# EAGLE design modular_expansion_system_audio_mixer (EAGLE 9.2.1)
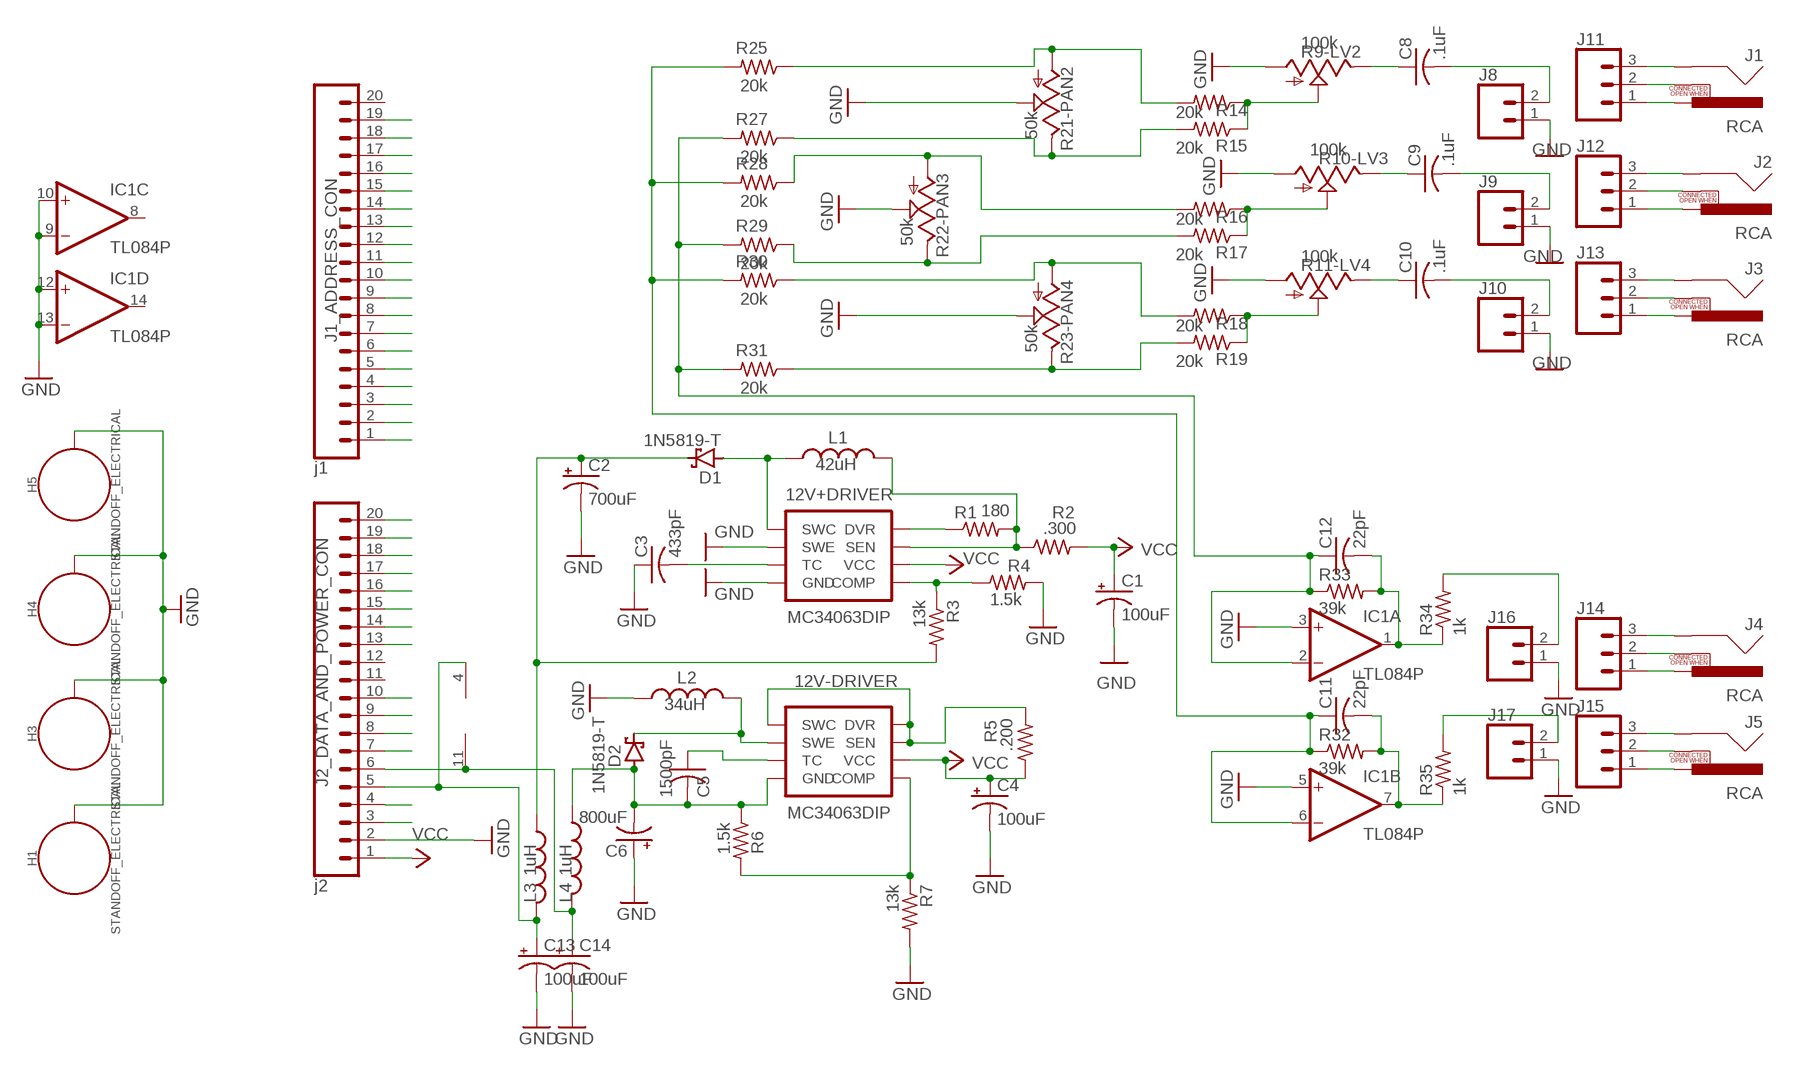
[diagram p0: schematic, sheet 1]

## Parts
12V+DRIVER  MC34063DIP  [DIP-08]
12V-DRIVER  MC34063DIP  [DIP-08]
C1  100uF  CPOL-USE2.5-5  [E2,5-5]
C2  700uF  CPOL-USE3.5-10  [E3,5-10]
C3  433pF  C-US025-040X050  [C025-040X050]
C4  100uF  CPOL-USE2.5-5  [E2,5-5]
C5  1500pF  C-US025-040X050  [C025-040X050]
C6  800uF  CPOL-USE3.5-10  [E3,5-10]
C8  .1uF  C-US025-024X044  [C025-024X044]
C9  .1uF  C-US025-024X044  [C025-024X044]
C10  .1uF  C-US025-024X044  [C025-024X044]
C11  22pF  C-US025-024X044  [C025-024X044]
C12  22pF  C-US025-024X044  [C025-024X044]
C13  100uF  CPOL-USE2.5-5  [E2,5-5]
C14  100uF  CPOL-USE2.5-5  [E2,5-5]
D1  1N5819-T  [DO41-7.6]
D2  1N5819-T  [DO41-7.6]
H1  STANDOFF_ELECTRICAL  [STANDOFF-ELECTRICAL]
H3  STANDOFF_ELECTRICAL  [STANDOFF-ELECTRICAL]
H4  STANDOFF_ELECTRICAL  [STANDOFF-ELECTRICAL]
H5  STANDOFF_ELECTRICAL  [STANDOFF-ELECTRICAL]
IC1  TL084P  [DIL14]
J1  RCA  [RCA]
J1_ADDRESS_CON  j1  CONN_20  [1X20]
J2  RCA  [RCA]
J2_DATA_AND_POWER_CON  j2  CONN_20  [1X20]
J3  RCA  [RCA]
J4  RCA  [RCA]
J5  RCA  [RCA]
J8  CONN_02  [1X02]
J9  CONN_02  [1X02]
J10  CONN_02  [1X02]
J11  CONN_03  [1X03]
J12  CONN_03  [1X03]
J13  CONN_03  [1X03]
J14  CONN_03  [1X03]
J15  CONN_03  [1X03]
J16  CONN_02  [1X02]
J17  CONN_02  [1X02]
L1  42uH  L-US0207/7  [0207/7]
L2  34uH  L-US0207/7  [0207/7]
L3  1uH  L-US0207/5V  [0207/5V]
L4  1uH  L-US0207/5V  [0207/5V]
R1  180  R-US_0204/2V  [0204V]
R2  .300  R-US_0204/2V  [0204V]
R3  13k  R-US_0204/2V  [0204V]
R4  1.5k  R-US_0204/2V  [0204V]
R5  .200  R-US_0204/2V  [0204V]
R6  1.5k  R-US_0204/2V  [0204V]
R7  13k  R-US_0204/2V  [0204V]
R9-LV2  100k  TRIM_US-B25U  [B25U]
R10-LV3  100k  TRIM_US-B25U  [B25U]
R11-LV4  100k  TRIM_US-B25U  [B25U]
R14  20k  R-US_0204/2V  [0204V]
R15  20k  R-US_0204/2V  [0204V]
R16  20k  R-US_0204/2V  [0204V]
R17  20k  R-US_0204/2V  [0204V]
R18  20k  R-US_0204/2V  [0204V]
R19  20k  R-US_0204/2V  [0204V]
R21-PAN2  50k  TRIM_US-B25U  [B25U]
R22-PAN3  50k  TRIM_US-B25U  [B25U]
R23-PAN4  50k  TRIM_US-B25U  [B25U]
R25  20k  R-US_0204/2V  [0204V]
R27  20k  R-US_0204/2V  [0204V]
R28  20k  R-US_0204/2V  [0204V]
R29  20k  R-US_0204/2V  [0204V]
R30  20k  R-US_0204/2V  [0204V]
R31  20k  R-US_0204/2V  [0204V]
R32  39k  R-US_0204/2V  [0204V]
R33  39k  R-US_0204/2V  [0204V]
R34  1k  R-US_0204/2V  [0204V]
R35  1k  R-US_0204/2V  [0204V]

## Nets
+12V: C2.+ D1.C L3.1 R3.2
+12V_FILTERED: C13.+ IC1.4(P:V+) J2_DATA_AND_POWER_CON.5 L3.2
-12V: 12V-DRIVER.4(GND) C5.2 C6.- D2.A L4.1 R6.1
-12V-FILTERED: C14.+ IC1.11(P:V-) J2_DATA_AND_POWER_CON.6 L4.2
A0: J1_ADDRESS_CON.1
A1: J1_ADDRESS_CON.2
A2: J1_ADDRESS_CON.3
A3: J1_ADDRESS_CON.4
A4: J1_ADDRESS_CON.5
A5: J1_ADDRESS_CON.6
A6: J1_ADDRESS_CON.7
A7: J1_ADDRESS_CON.8
A8: J1_ADDRESS_CON.9
A9: J1_ADDRESS_CON.10
A10: J1_ADDRESS_CON.11
A11: J1_ADDRESS_CON.12
A12: J1_ADDRESS_CON.13
A13: J1_ADDRESS_CON.14
A14: J1_ADDRESS_CON.15
A15: J1_ADDRESS_CON.16
CAS*: J2_DATA_AND_POWER_CON.9
D0: J2_DATA_AND_POWER_CON.20
D1: J2_DATA_AND_POWER_CON.19
D2: J2_DATA_AND_POWER_CON.18
D3: J2_DATA_AND_POWER_CON.17
D4: J2_DATA_AND_POWER_CON.16
D5: J2_DATA_AND_POWER_CON.15
D6: J2_DATA_AND_POWER_CON.14
D7: J2_DATA_AND_POWER_CON.13
GND: 12V+DRIVER.2(SWE) 12V+DRIVER.4(GND) C1.- C2.- C3.1 C4.- C6.+ C13.- C14.- H1.P1 H3.P1 H4.P1 H5.P1 IC1.3(A:+IN) IC1.5(B:+IN) IC1.9(C:-IN) IC1.10(C:+IN) IC1.12(D:+IN) IC1.13(D:-IN) J2_DATA_AND_POWER_CON.2 J8.1 J9.1 J10.1 J16.1 J17.1 L2.1 R4.2 R7.2 R9-LV2.A R10-LV3.A R11-LV4.A R21-PAN2.S R22-PAN3.S R23-PAN4.S
IN*: J1_ADDRESS_CON.17
INTAK*: J2_DATA_AND_POWER_CON.7
N$1: 12V+DRIVER.8(DVR) R1.1
N$2: 12V+DRIVER.7(SEN) L1.2 R1.2 R2.1
N$3: 12V+DRIVER.1(SWC) D1.A L1.1
N$4: 12V+DRIVER.3(TC) C3.2
N$5: 12V+DRIVER.5(COMP) R3.1 R4.1
N$6: 12V-DRIVER.1(SWC) 12V-DRIVER.7(SEN) 12V-DRIVER.8(DVR) R5.2
N$7: 12V-DRIVER.3(TC) C5.1
N$8: 12V-DRIVER.2(SWE) D2.C L2.2
N$9: 12V-DRIVER.5(COMP) R6.2 R7.1
N$15: J3.SHELL J13.3
N$16: J3.SWITCH J13.2
N$17: J3.PIN J13.1
N$18: J2.PIN J12.1
N$19: J2.SWITCH J12.2
N$20: J2.SHELL J12.3
N$21: J1.SHELL J11.3
N$22: J1.SWITCH J11.2
N$23: J1.PIN J11.1
N$24: J4.SHELL J14.3
N$25: J4.SWITCH J14.2
N$26: J4.PIN J14.1
N$27: J5.SHELL J15.3
N$28: J5.SWITCH J15.2
N$29: J5.PIN J15.1
N$31: C8.1 R9-LV2.E
N$32: C9.1 R10-LV3.E
N$33: C10.1 R11-LV4.E
N$35: C8.2 J8.2
N$36: C10.2 J10.2
N$37: C9.2 J9.2
N$39: R9-LV2.S R14.1 R15.1
N$40: R10-LV3.S R16.1 R17.1
N$41: R11-LV4.S R18.1 R19.1
N$44: R14.2 R21-PAN2.A R25.1
N$45: R15.2 R21-PAN2.E R27.1
N$46: R16.2 R22-PAN3.A R28.1
N$47: R17.2 R22-PAN3.E R29.1
N$48: R18.2 R23-PAN4.A R30.1
N$49: R19.2 R23-PAN4.E R31.1
N$51: C11.1 IC1.6(B:-IN) R25.2 R28.2 R30.2 R32.1
N$53: C12.2 IC1.1(A:OUT) R33.2 R34.1
N$54: C12.1 IC1.2(A:-IN) R27.2 R29.2 R31.2 R33.1
N$56: C11.2 IC1.7(B:OUT) R32.2 R35.1
N$60: J16.2 R34.2
N$61: J17.2 R35.2
OUT*: J1_ADDRESS_CON.18
RAS*: J2_DATA_AND_POWER_CON.10
RD*: J1_ADDRESS_CON.19
SYSRES*: J2_DATA_AND_POWER_CON.8
UNREG+: J2_DATA_AND_POWER_CON.4
VCC: 12V+DRIVER.6(VCC) 12V-DRIVER.6(VCC) C1.+ C4.+ J2_DATA_AND_POWER_CON.1 R2.2 R5.1
VCC/2: J2_DATA_AND_POWER_CON.3
Unconnected: IC1.8(C:OUT) IC1.14(D:OUT) J1_ADDRESS_CON.20 J2_DATA_AND_POWER_CON.11 J2_DATA_AND_POWER_CON.12

## Library data of the parts
12V+DRIVER 12V-DRIVER = SparkFun-IC-Power:MC34063: Jellybean switching supply controller (IC-11612, also SF)
C1 C2 C4 C6 C13 C14 = resistor:CPOL-US: POLARIZED CAPACITOR, American symbol
C3 C5 C8-C12 = rcl:C-US: CAPACITOR, American symbol; SPICEPREFIX: C
D1 D2 = diode:1N581*: 1.0A SCHOTTKY BARRIER RECTIFIER Source: http://www.diodes.com/datasheets/ds23001.pdf
H1 H3-H5 = SparkFun-Hardware:STANDOFF_ELECTRICAL: Stand Off Drill holes with an electrical connection. For example, use these to ground your board to a chassis. Example SparkFun Products Screw - Phillips Head (1/4", 4-40, 10 pack) <https://www.sparkfun.com/products/10453> (PRT-10453) Screw - Phillips Head (1/2", 4-40, 10 pack) <https://www.sparkfun.com/products/10452> (PRT-10452) Screw - Phillips Head (3/4", 4-40, 10 pack) <https://www.sparkfun.com/products/10451> (PRT-10451) Screw - Phillips Head (1", 4-40, 10 pack) <https://www.sparkfun.com/products/10450> (PRT-10450)
IC1 = linear:TL084: OP AMP
J1-J5 = SparkFun-Connectors:RCA: RCA Jack connector This is a right angle RCA jack connecotr. Commonly used for video or audio. Here is the connector we sell at SparkFun: RCA Jack <https://www.sparkfun.com/products/8631> (PRT-08631) Datasheet <http://www.sparkfun.com/datasheets/Prototyping/Connectors/RCA-Jack.pdf> It is not used on any active designs, however it was used on a couple retired products: RCA Jack Breakout [RETIRED] <https://www.sparkfun.com/products/8826> (PRT-08826) SparkFun On Screen Display Breakout - MAX7456 [RETIRED] <https://www.sparkfun.com/products/9168> (BOB-09168) You may also be interested in a cable: RCA Video Cable - 6' <https://www.sparkfun.com/products/11573> (CAB-11573); PROD_ID: CONN-09081; SF_ID: PRT-08631
J1_ADDRESS_CON J2_DATA_AND_POWER_CON = SparkFun-Connectors:CONN_20: Multi connection point. Often used as Generic Header-pin footprint for 0.1 inch spaced/style header connections On any of the 0.1 inch spaced packages, you can populate with these: Break Away Headers - Straight <https://www.sparkfun.com/products/116> (PRT-00116) Break Away Male Headers - Right Angle <https://www.sparkfun.com/products/553> (PRT-00553) Female Headers <https://www.sparkfun.com/products/115> (PRT-00115) Break Away Headers - Machine Pin <https://www.sparkfun.com/products/117> (PRT-00117) Break Away Female Headers - Swiss Machine Pin <https://www.sparkfun.com/products/743> (PRT-00743) For SCREWTERMINALS and SPRING TERMINALS visit here: Screw Terimnals on SparkFun.com <https://www.sparkfun.com/search/results?term=Screw+Terminals> (5mm/3.5mm/2.54mm spacing) This device is also useful as a general connection point to wire up your design to another part of your project. Our various solder wires solder well into these plated through hole pads. Hook-Up Wire - Assortment (Stranded, 22 AWG) <https://www.sparkfun.com/products/11375> (PRT-11375) Hook-Up Wire - Assortment (Solid Core, 22 AWG) <https://www.sparkfun.com/products/11367> (PRT-11367) View the entire wire category on our website here <https://www.sparkfun.com/categories/141> Special notes: Molex polarized connector foot print use with SKU : PRT-08231 with associated crimp pins and housings. 1MM SMD Version SKU: PRT-10208 NOTES ON THE VARIANTS LOCK and LOCK_LONGPADS... This footprint was designed to help hold the alignment of a through-hole component (i.e. 6-pin header) while soldering it into place. You may notice that each hole has been shifted either up or down by 0.005 of an inch from it's more standard position (which is a perfectly straight line). This slight alteration caused the pins (the squares in the middle) to touch the edges of the holes. Because they are alternating, it causes a "brace" to hold the component in place. 0.005 has proven to be the perfect amount of "off-center" position when using our standard breakaway headers. Although looks a little odd when you look at the bare footprint, once you have a header in there, the alteration is very hard to notice. Also,if you push a header all the way into place, it is covered up entirely on the bottom side. Note about LOCK SPECIAL package: This is just like the LOCK variant in that the holes are staggared by 5 mil, but except for the last two holes. They are not altered from the "standard" footprint layout. This is used for a special purpose on the layout of our Graphic LCD Backpack. Make sure you want to use this device before selecting it for you project!
J8-J10 J16 J17 = SparkFun-Connectors:CONN_02: Multi connection point. Often used as Generic Header-pin footprint for 0.1 inch spaced/style header connections On any of the 0.1 inch spaced packages, you can populate with these: Break Away Headers - Straight <https://www.sparkfun.com/products/116> (PRT-00116) Break Away Male Headers - Right Angle <https://www.sparkfun.com/products/553> (PRT-00553) Female Headers <https://www.sparkfun.com/products/115> (PRT-00115) Break Away Headers - Machine Pin <https://www.sparkfun.com/products/117> (PRT-00117) Break Away Female Headers - Swiss Machine Pin <https://www.sparkfun.com/products/743> (PRT-00743) For SCREWTERMINALS and SPRING TERMINALS visit here: Screw Terimnals on SparkFun.com <https://www.sparkfun.com/search/results?term=Screw+Terminals> (5mm/3.5mm/2.54mm spacing) This device is also useful as a general connection point to wire up your design to another part of your project. Our various solder wires solder well into these plated through hole pads. Hook-Up Wire - Assortment (Stranded, 22 AWG) <https://www.sparkfun.com/products/11375> (PRT-11375) Hook-Up Wire - Assortment (Solid Core, 22 AWG) <https://www.sparkfun.com/products/11367> (PRT-11367) View the entire wire category on our website here <https://www.sparkfun.com/categories/141> Special notes: Molex polarized connector foot print use with: PRT-08233 with associated crimp pins and housings. 2.54_SCREWTERM for use with PRT-10571. 3.5mm Screw Terminal footprints for PRT-08084 5mm Screw Terminal footprints for use with PRT-08432
J11-J15 = SparkFun-Connectors:CONN_03: Multi connection point. Often used as Generic Header-pin footprint for 0.1 inch spaced/style header connections On any of the 0.1 inch spaced packages, you can populate with these: Break Away Headers - Straight <https://www.sparkfun.com/products/116> (PRT-00116) Break Away Male Headers - Right Angle <https://www.sparkfun.com/products/553> (PRT-00553) Female Headers <https://www.sparkfun.com/products/115> (PRT-00115) Break Away Headers - Machine Pin <https://www.sparkfun.com/products/117> (PRT-00117) Break Away Female Headers - Swiss Machine Pin <https://www.sparkfun.com/products/743> (PRT-00743) Stackable Header - 3 Pin (Female, 0.1") <https://www.sparkfun.com/products/13875> (PRT-13875) For SCREWTERMINALS and SPRING TERMINALS visit here: Screw Terimnals on SparkFun.com <https://www.sparkfun.com/search/results?term=Screw+Terminals> (5mm/3.5mm/2.54mm spacing) This device is also useful as a general connection point to wire up your design to another part of your project. Our various solder wires solder well into these plated through hole pads. Hook-Up Wire - Assortment (Stranded, 22 AWG) <https://www.sparkfun.com/products/11375> (PRT-11375) Hook-Up Wire - Assortment (Solid Core, 22 AWG) <https://www.sparkfun.com/products/11367> (PRT-11367) View the entire wire category on our website here <https://www.sparkfun.com/categories/141> Special notes: Molex polarized connector foot print use with SKU : PRT-08232 with associated crimp pins and housings.
L1 L2 = resistor:L-US: INDUCTOR, American symbol
L3 L4 = rcl:L-US: INDUCTOR, American symbol; SPICEPREFIX: L
R1-R7 R14-R19 R25 R27-R35 = resistor:R-US_: RESISTOR, American symbol
R9-LV2 R10-LV3 R11-LV4 R21-PAN2 R22-PAN3 R23-PAN4 = pot:TRIM_US-: POTENTIOMETER

## Net classes
0 default: width 0.3 mm

## Board
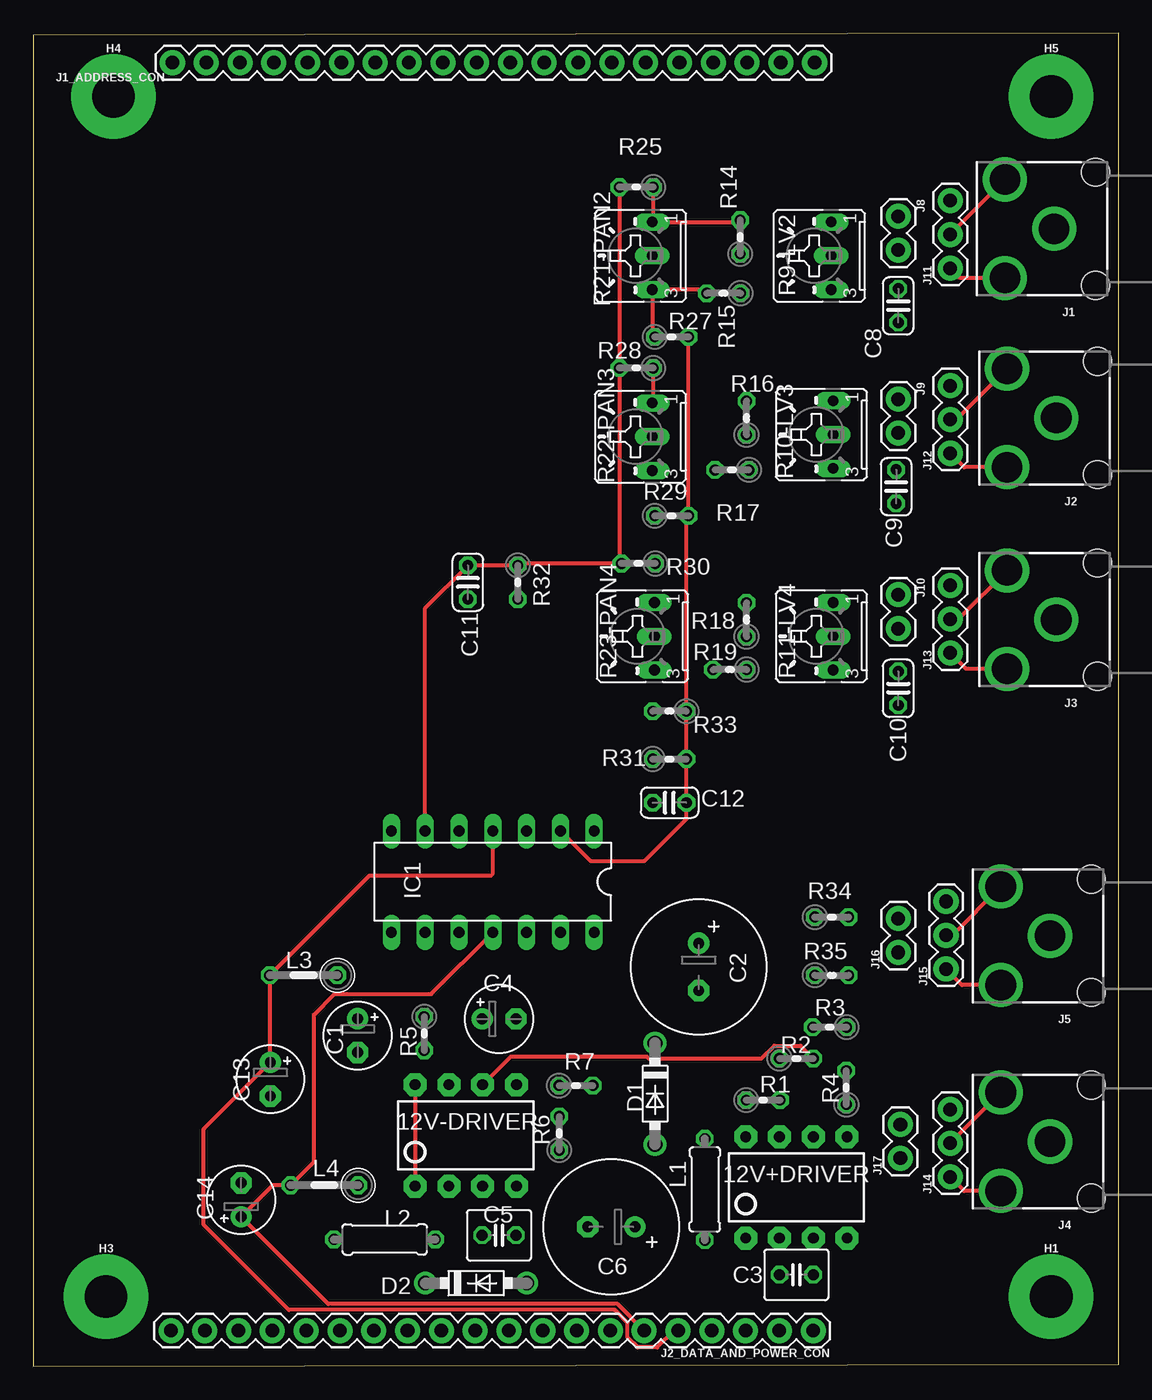
[diagram p1: board, top side]
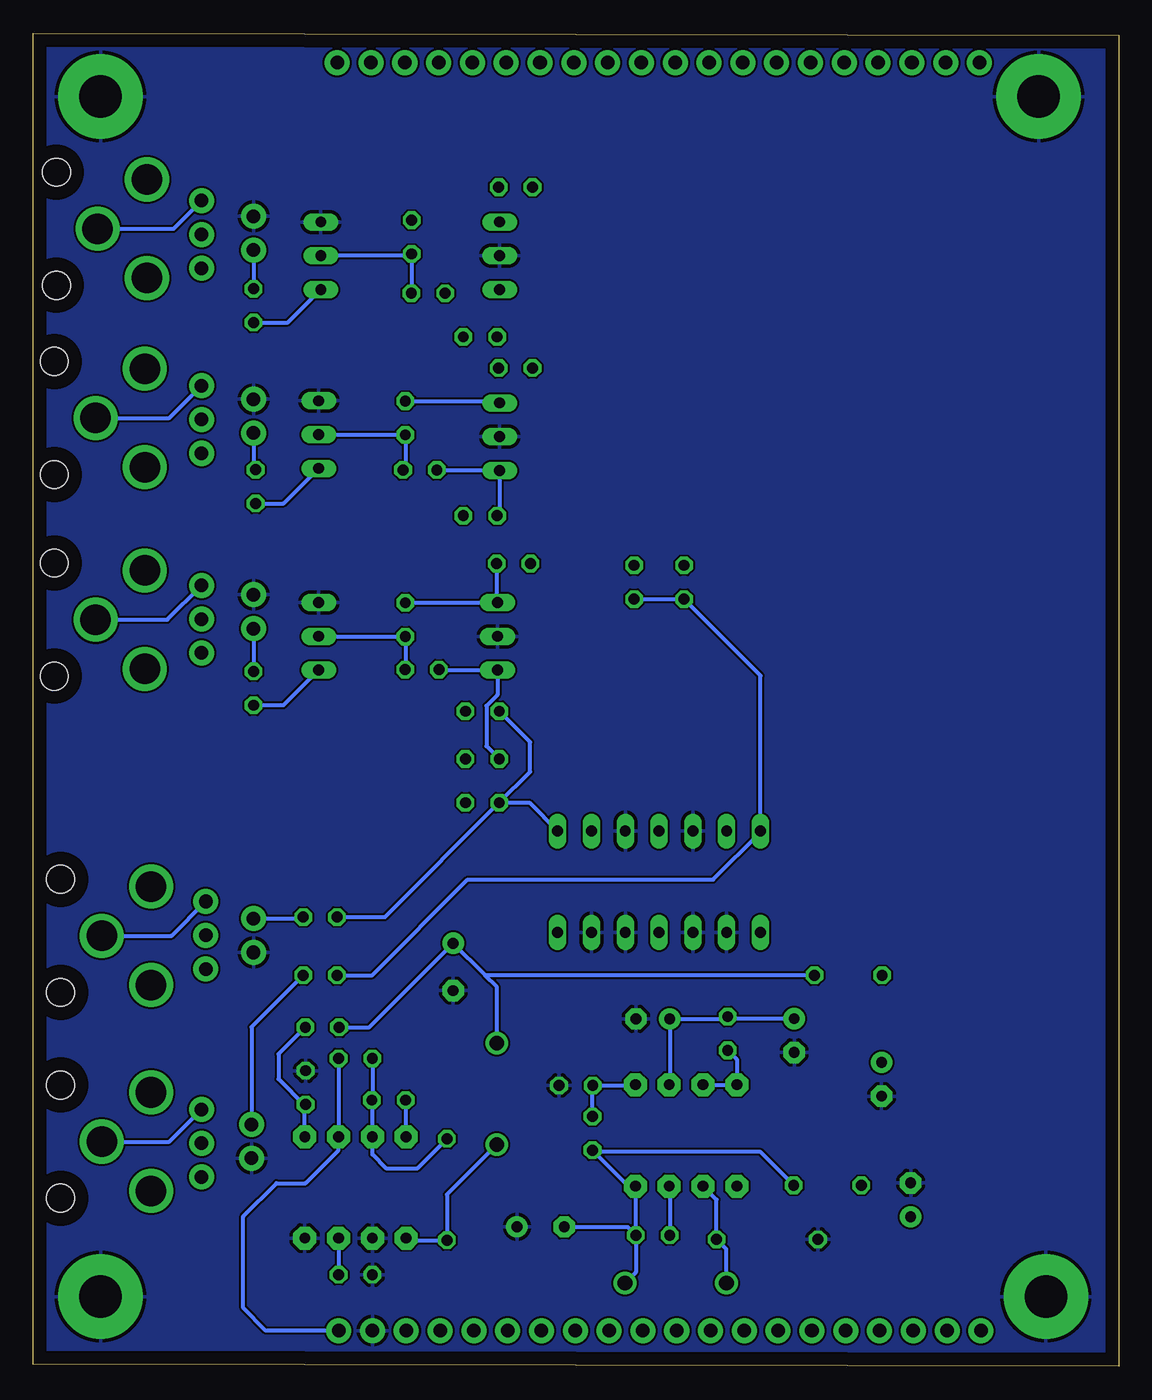
[diagram p2: board, bottom side, seen from below]

Size 81.56 x 100.16 mm. Coordinates in mm from the lower left corner, seen from the top.
Outline: 0,0 81.56,0.16 81.56,100.16 0,100 0,0
Copper layers (1*16): Top 0.035mm / dielectric 1.5mm / Bottom 0.035mm
Design rules "default": minimum track width 6mil, minimum drill 0.35mm, track to track 6mil, track to pad 6mil, pad to pad 6mil, via to via 6mil, smd to smd 6mil, copper to edge 40mil, drill to drill 6mil, minimum pad ring 10mil, minimum via ring 8mil, stop-mask expansion 4mil, vias tented up to drill 0mil, thermal gap 10mil

### Footprints (pad centres in the part's own frame; a part is rotated, then mirrored left to right if it is on the bottom)
DIP-08 = drill 0.813 pad 1.727 octagon: 1 -3.81,-3.81; 2 -1.27,-3.81; 3 1.27,-3.81; 4 3.81,-3.81; 5 3.81,3.81; 6 1.27,3.81; 7 -1.27,3.81; 8 -3.81,3.81
E2,5-5 = drill 0.813 pad 1.6: + -1.27,0 | drill 0.813 pad 1.6 octagon: - 1.27,0
E3,5-10 = drill 0.813 pad 1.6: + -1.778,0 | drill 0.813 pad 1.6 octagon: - 1.778,0
C025-040X050 = drill 0.813 octagon: 1 -1.27,0; 2 1.27,0
C025-024X044 = drill 0.813 octagon: 1 -1.27,0; 2 1.27,0
DO41-7.6 = drill 1.1 pad 1.7: A 3.81,0; C -3.81,0
STANDOFF-ELECTRICAL = drill 3.2 pad 6.35: P1 0,0
DIL14 = drill 0.813 long: 1 -7.62,-3.81; 2 -5.08,-3.81; 3 -2.54,-3.81; 4 0,-3.81; 5 2.54,-3.81; 6 5.08,-3.81; 7 7.62,-3.81; 8 7.62,3.81; 9 5.08,3.81; 10 2.54,3.81; 11 0,3.81; 12 -2.54,3.81; 13 -5.08,3.81; 14 -7.62,3.81
RCA = drill 2.3: PIN 3.7,3.7; SHELL 0,0; SWITCH 3.7,-3.7 | hole 2.1: -3.1,4.25; -3.1,-4.25
1X20 = drill 1.016 pad 1.88: 1 0,0; 2 2.54,0; 3 5.08,0; 4 7.62,0; 5 10.16,0; 6 12.7,0; 7 15.24,0; 8 17.78,0; 9 20.32,0; 10 22.86,0; 11 25.4,0; 12 27.94,0; 13 30.48,0; 14 33.02,0; 15 35.56,0; 16 38.1,0; 17 40.64,0; 18 43.18,0; 19 45.72,0; 20 48.26,0
1X02 = drill 1.016 pad 1.88: 1 0,0; 2 2.54,0
1X03 = drill 1.016 pad 1.88: 1 0,0; 2 2.54,0; 3 5.08,0
0207/7 = drill 0.813 octagon: 1 -3.81,0; 2 3.81,0
0207/5V = drill 0.813 octagon: 1 -2.54,0; 2 2.54,0
0204V = drill 0.813 octagon: 1 -1.27,0; 2 1.27,0
B25U = drill 0.813 long: A 2.54,-0.889; E -2.54,-0.889; S 0,-0.889

### Placement (x,y rotation side)
12V+DRIVER  57.34,13.44 0 top
12V-DRIVER  32.5,17.34 0 top
C1  24.38,24.84 270 top
C2  50,30 270 top
C3  57.34,6.88 0 top
C4  35,26.09 0 top
C5  35,9.84 0 top
C6  43.44,10.47 180 top
C8  65,79.69 90 top
C9  64.84,66.09 90 top
C10  65,50.94 90 top
C11  32.66,58.91 270 top
C12  47.81,42.34 180 top
C13  17.81,21.56 270 top
C14  15.62,12.5 90 top
D1  46.72,20.47 270 top
D2  33.28,6.25 0 top
H1  76.5,5.24 0 top
H3  5.47,5.24 0 top
H4  6.01,95.41 0 top
H5  76.5,95.41 0 top
IC1  34.53,36.41 180 top
J1  76.72,85.47 180 top
J1_ADDRESS_CON  10.46,97.95 0 top
J2  76.88,71.25 180 top
J2_DATA_AND_POWER_CON  58.61,2.68 180 top
J3  76.88,56.09 180 top
J4  76.41,16.88 180 top
J5  76.41,32.34 180 top
J8  65,86.41 270 top
J9  65,72.66 270 top
J10  65,57.97 270 top
J11  68.91,82.5 90 top
J12  68.91,68.59 90 top
J13  68.91,53.59 90 top
J14  68.91,14.22 90 top
J15  68.59,29.84 90 top
J16  65,31.09 90 top
J17  65.16,15.62 90 top
L1  50.47,13.28 90 top
L2  26.41,9.53 0 top
L3  20.31,29.38 180 top
L4  21.88,13.59 180 top
R1  54.84,20 0 top
R2  57.34,23.12 0 top
R3  59.84,25.47 180 top
R4  61.09,20.94 90 top
R5  29.38,25 270 top
R6  39.53,17.5 90 top
R7  40.78,21.09 0 top
R9-LV2  59.06,83.44 90 top
R10-LV3  59.22,70 90 top
R11-LV4  59.22,54.84 90 top
R14  53.12,84.84 90 top
R15  51.88,80.62 180 top
R16  53.59,71.25 90 top
R17  52.5,67.34 180 top
R18  53.59,56.09 90 top
R19  52.34,52.34 180 top
R21-PAN2  45.62,83.44 90 top
R22-PAN3  45.62,69.84 90 top
R23-PAN4  45.78,54.84 90 top
R25  45.31,88.59 180 top
R27  47.97,77.34 0 top
R28  45.31,75 180 top
R29  47.97,63.91 0 top
R30  45.47,60.31 180 top
R31  47.81,45.62 0 top
R32  36.41,58.91 270 top
R33  47.81,49.22 180 top
R34  60,33.75 0 top
R35  60,29.38 0 top

### Tracks (layer width: path | path; a pad name or v marks a point on that pad's centre or on a via)
+12V
  Bottom 0.3: R3.2 56.31,25.47 C2.+ 47.63,29.4 47.6,29.37 | D1.C 46.72,28.5 47.6,29.37 | L3.1 47.6,29.37
+12V_FILTERED
  Top 0.3: J2_DATA_AND_POWER_CON.5 48.15,2.68 46.88,1.41 45.42,1.41 44.66,2.16 44.66,3.28 43.71,4.23 19.2,4.23 12.81,10.62 12.81,17.83 C13.+ 17.77,22.87 L3.2 25.27,36.87 34.38,36.87 34.53,37.03 IC1.4
-12V
  Bottom 0.3: C5.2 36.27,7.07 D2.A | C6.- 36.9,10.47 C5.2 | C5.2 36.31,9.88 12V-DRIVER.4 36.84,13.53 R6.1 39.4,16.09 26.91,16.09 L4.1
-12V-FILTERED
  Top 0.3: J2_DATA_AND_POWER_CON.6 43.91,4.68 43.91,4.69 22.17,4.69 C14.+ 17.99,13.59 L4.2 21.09,15.35 21.09,26.41 22.66,27.97 29.9,27.97 IC1.11
GND
  pour Bottom: 0.94,100.16 81.09,100.16 81.56,99.69 81.56,0 0.94,0 0.94,99.84 1.09,100
N$1
  Bottom 0.3: R1.1 53.57,17.29 12V+DRIVER.8
N$2
  Bottom 0.3: L1.2 52.72,14.84 55,14.84 56.07,15.92 12V+DRIVER.7 56.11,17.29 R1.2 56.07,20.04 R2.1
N$3
  Bottom 0.3: 12V+DRIVER.1 53.38,9.47 L1.1 50.47,12.91 D1.A
N$4
  Bottom 0.3: 12V+DRIVER.3 C3.2
N$5
  Bottom 0.3: 12V+DRIVER.5 61.15,19.61 | 61.15,19.61 R4.1 | R3.1 63.13,23.46 63.13,21.58 61.15,19.61
N$6
  Top 0.3: 12V-DRIVER.8 12V-DRIVER.1
  Bottom 0.3: 12V-DRIVER.7 12V-DRIVER.8 28.69,23.04 R5.2
N$7
  Bottom 0.3: 12V-DRIVER.3 33.73,13.49 C5.1
N$8
  Bottom 0.3: D2.C 29.47,8.79 L2.2 30.22,12.52 12V-DRIVER.2
N$9
  Bottom 0.3: R6.2 39.53,21.07 R7.1 36.37,21.09 12V-DRIVER.5
N$15
  Bottom 0.3: J3.SHELL 71.49,56.09 J13.3
N$16
  Top 0.3: J3.SWITCH 69.52,56.13 J13.2
N$17
  Top 0.3: J3.PIN 70.11,52.39 J13.1
N$18
  Top 0.3: J2.PIN 69.95,67.55 J12.1
N$19
  Top 0.3: J2.SWITCH 69.36,71.13 J12.2
N$20
  Bottom 0.3: J2.SHELL 71.33,71.25 J12.3
N$21
  Bottom 0.3: J1.SHELL 71.02,85.47 J11.3
N$22
  Top 0.3: J1.SWITCH 68.91,85.06 J11.2
N$23
  Top 0.3: J1.PIN 69.64,81.77 J11.1
N$24
  Bottom 0.3: J4.SHELL 71.33,16.87 J14.3
N$25
  Top 0.3: J4.SWITCH 68.91,16.77 J14.2
N$26
  Top 0.3: J4.PIN 69.95,13.17 J14.1
N$27
  Bottom 0.3: J5.SHELL 71.17,32.34 J15.3
N$28
  Top 0.3: J5.SWITCH 69.05,32.38 J15.2
N$29
  Top 0.3: J5.PIN 69.79,28.64 J15.1
N$31
  Bottom 0.3: C8.1 62.43,78.42 R9-LV2.E
N$32
  Bottom 0.3: C9.1 62.74,64.82 R10-LV3.E
N$33
  Bottom 0.3: C10.1 62.74,49.67 R11-LV4.E
N$35
  Bottom 0.3: J8.2 C8.2
N$36
  Bottom 0.3: J10.2 C10.2
N$37
  Bottom 0.3: J9.2 65,67.52 C9.2
N$39
  Bottom 0.3: R15.1 53.13,80.64 R14.1 53.26,83.44 R9-LV2.S
N$40
  Bottom 0.3: R10-LV3.S 53.61,70 R16.1 53.59,67.52 R17.1
N$41
  Bottom 0.3: R11-LV4.S 60.09,54.82 R18.1 53.59,52.36 R19.1
N$44
  Top 0.3: R25.1 46.58,86.05 R21-PAN2.A 52.99,85.98 R14.2
N$45
  Top 0.3: R27.1 46.51,77.53 R21-PAN2.E 50.33,80.9 R15.2
N$46
  Top 0.3: R28.1 46.58,72.45 R22-PAN3.A
  Bottom 0.3: R16.2 46.65,72.52 R22-PAN3.A
N$47
  Bottom 0.3: R17.2 46.55,67.34 R22-PAN3.E 46.51,64.09 R29.1
N$48
  Bottom 0.3: R30.1 46.74,57.45 R23-PAN4.A 46.69,57.36 R18.2
N$49
  Bottom 0.3: R31.1 47.51,46.59 47.51,49.62 46.67,50.45 R23-PAN4.E 51.03,52.3 R19.2
N$51
  Top 0.3: R25.2 R28.2 44.04,60.47 R30.2 36.54,60.31 R32.1 C11.1 29.45,56.97 IC1.6
N$53
  Bottom 0.3: R34.1 55.14,33.75 C12.2 | C12.2 44.28,42.34 IC1.1 | C12.2 44.22,44.67 44.22,46.89 R33.2
N$54
  Top 0.3: IC1.2 41.86,37.97 45.94,37.97 49.08,41.11 C12.1 R31.2 R33.1 49.08,63.75 R29.2 R27.2
N$56
  Bottom 0.3: R35.1 56.09,29.37 48.91,36.56 30.47,36.56 26.91,40.12 IC1.7 26.91,51.89 C11.2 R32.2
N$60
  Bottom 0.3: J16.2 61.39,33.63 R34.2
N$61
  Bottom 0.3: R35.2 65.16,25.49 J17.2
VCC
  Top 0.3: 12V-DRIVER.6 35.9,23.28 46.09,23.28 46.24,23.13 54.71,23.13 55.67,24.09 57.65,24.09 R2.2
  Bottom 0.3: J2_DATA_AND_POWER_CON.1 64.08,2.68 65.78,4.37 65.78,11.25 63.28,13.75 61.09,13.75 58.61,16.23 12V+DRIVER.6 R2.2 | 12V-DRIVER.6 33.73,21.19 C4.+ 29.55,26.09 29.53,26.11 | 29.53,26.11 R5.1 | C1.+ 29.53,26.11